# Altium schematic sheet Processor.SchDoc
size A
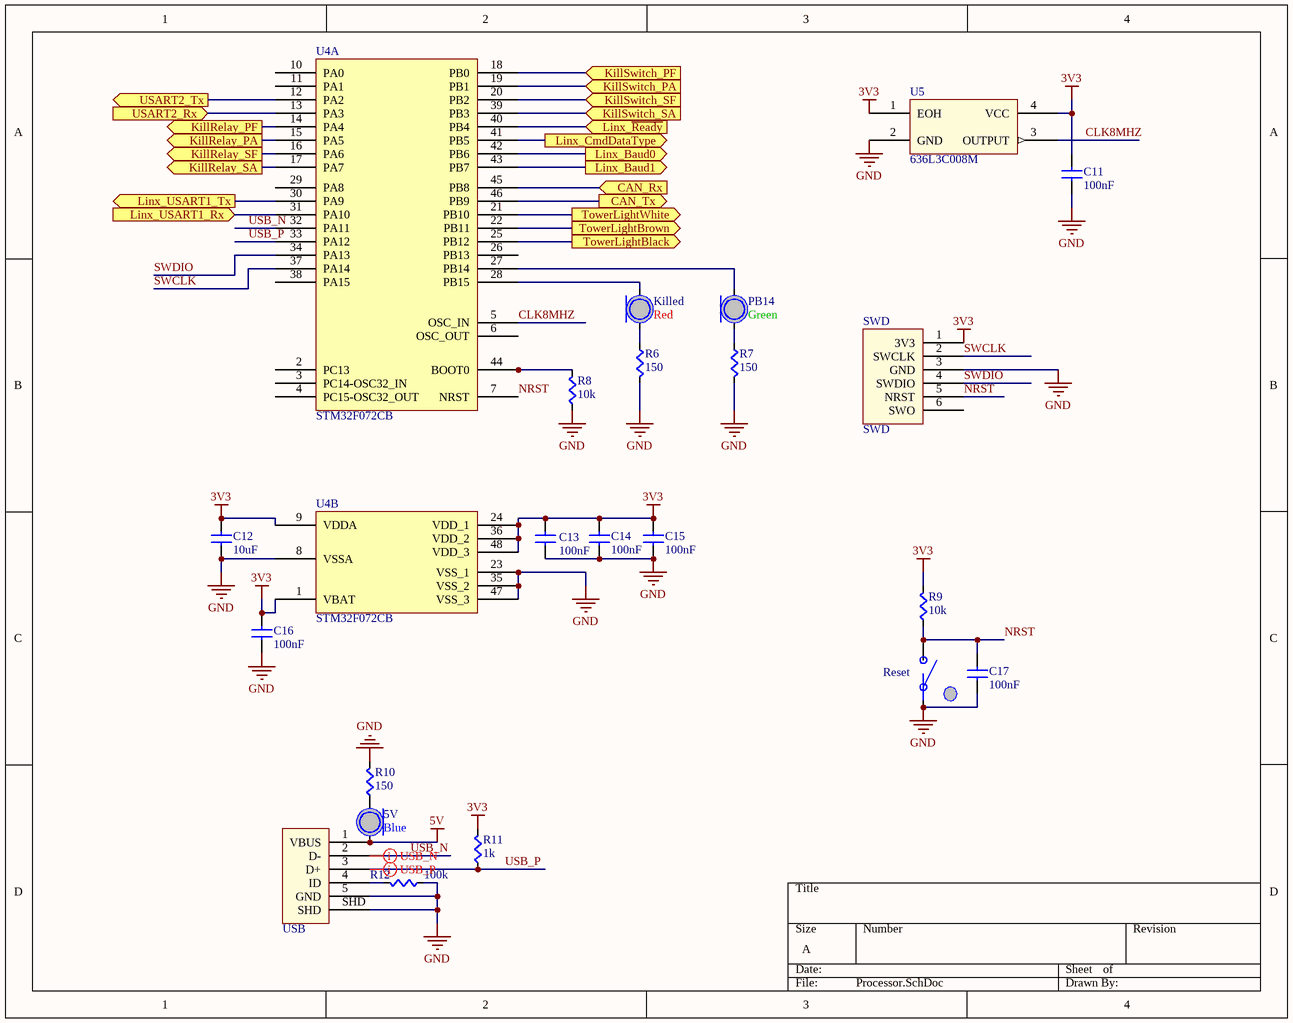
[diagram p0: Processor.SchDoc]

## Parts
5V  Color: Blue  [LED0603]  (hidden comment: LED)
C11  value 100nF  [CAPC0603]  (hidden comment: Cap)
C12  value 10uF  [CAPC0603]  (hidden comment: Cap)
C13  value 100nF  [CAPC0603]  (hidden comment: Cap)
C14  value 100nF  [CAPC0603]  (hidden comment: Cap)
C15  value 100nF  [CAPC0603]  (hidden comment: Cap)
C16  value 100nF  [CAPC0603]  (hidden comment: Cap)
C17  value 100nF  [CAPC0603]  (hidden comment: Cap)
Killed  Color: Red  [LED0603]  (hidden comment: LED)
PB14  Color: Green  [LED0603]  (hidden comment: LED)
R6  value 150  [RES0603]  (hidden comment: Res)
R7  value 150  [RES0603]  (hidden comment: Res)
R8  value 10k  [RES0603]  (hidden comment: Res)
R9  value 10k  [RES0603]  (hidden comment: Res)
R10  value 150  [RES0603]  (hidden comment: Res)
R11  value 1k  [RES0603]  (hidden comment: Res)
R12  value 100k  [RES0603]  (hidden comment: Res)
Reset  Button  [PTS645xxxxSMTR92]  (value not drawn)
SWD  SWD  [SWD_STM32]
U4  STM32F072CB  [STM32F072CB]  (parts A,B of 2)
U5  636L3C008M  [636L3C]
USB  USB Micro  [10118192-0001LF]  (value not drawn)

## Ports
CAN_Rx (in), CAN_Tx (out), KillRelay_PA (out), KillRelay_PF (out), KillRelay_SA (out), KillRelay_SF (out), KillSwitch_PA (in), KillSwitch_PF (in), KillSwitch_SA (in), KillSwitch_SF (in), Linx_Baud0 (out), Linx_Baud1 (out), Linx_CmdDataType (out), Linx_USART1_Rx (in), Linx_USART1_Tx (out), Linx_~{Ready} (in), TowerLightBlack (out), TowerLightBrown (out), TowerLightWhite (out), USART2_Rx (in), USART2_Tx (out)

## Nets
3V3: C11.1(A) C12.2(B) C13.1(A) C14.1(A) C15.1(A) C16.1(A) R9.1(A) R11.1(A) SWD.1(3V3) U4.1(VBAT) U4.9(VDDA) U4.24(VDD_1) U4.36(VDD_2) U4.48(VDD_3) U5.1(EOH) U5.4(VCC)
5V: 5V.A USB.1(VBUS)
GND: C11.2(B) C12.1(A) C13.2(B) C14.2(B) C15.2(B) C16.2(B) C17.2(B) R6.1(A) R7.1(A) R8.2(B) R10.1(A) R12.2(B) Reset.A SWD.3(GND) U4.8(VSSA) U4.23(VSS_1) U4.35(VSS_2) U4.47(VSS_3) U5.2(GND) USB.5(GND) USB.SHD
CAN_Rx: U4.45(PB8) ; port CAN_Rx
CAN_Tx: U4.46(PB9) ; port CAN_Tx
CLK8MHZ: U4.5(OSC_IN) U5.3(OUTPUT)
KillRelay_PA: U4.15(PA5) ; port KillRelay_PA
KillRelay_PF: U4.14(PA4) ; port KillRelay_PF
KillRelay_SA: U4.17(PA7) ; port KillRelay_SA
KillRelay_SF: U4.16(PA6) ; port KillRelay_SF
KillSwitch_PA: U4.19(PB1) ; port KillSwitch_PA
KillSwitch_PF: U4.18(PB0) ; port KillSwitch_PF
KillSwitch_SA: U4.39(PB3) ; port KillSwitch_SA
KillSwitch_SF: U4.20(PB2) ; port KillSwitch_SF
Linx_Baud0: U4.42(PB6) ; port Linx_Baud0
Linx_Baud1: U4.43(PB7) ; port Linx_Baud1
Linx_CmdDataType: U4.41(PB5) ; port Linx_CmdDataType
Linx_~{Ready}: U4.40(PB4) ; port Linx_~{Ready}
Linx_USART1_Rx: U4.31(PA10) ; port Linx_USART1_Rx
Linx_USART1_Tx: U4.30(PA9) ; port Linx_USART1_Tx
NRST: C17.1(A) R9.2(B) Reset.B SWD.5(NRST) U4.7(NRST)
SWCLK: SWD.2(SWCLK) U4.37(PA14)
SWDIO: SWD.4(SWDIO) U4.34(PA13)
TowerLightBlack: U4.25(PB12) ; port TowerLightBlack
TowerLightBrown: U4.22(PB11) ; port TowerLightBrown
TowerLightWhite: U4.21(PB10) ; port TowerLightWhite
USART2_Rx: U4.13(PA3) ; port USART2_Rx
USART2_Tx: U4.12(PA2) ; port USART2_Tx
USB_N: U4.32(PA11) USB.2(D-)
USB_P: R11.2(B) U4.33(PA12) USB.3(D+)
Net5V_C: 5V.C R10.2(B)
NetKilled_A: Killed.A U4.28(PB15)
NetKilled_C: Killed.C R6.2(B)
NetPB14_A: PB14.A U4.27(PB14)
NetPB14_C: PB14.C R7.2(B)
NetR8_1: R8.1(A) U4.44(BOOT0)
NetR12_1: R12.1(A) USB.4(ID)

Not connected (* = marked no-connect by the designer): SWD 6(SWO); U4 2(PC13) 3(PC14-OSC32_IN) 4(PC15-OSC32_OUT) 6(OSC_OUT) 10(PA0) 11(PA1) 26(PB13) 29(PA8) 38(PA15)

## Layout directives
differential pair: USB_N, USB_P

## Library data of the parts
Reset = Button: SPST Button; Supplier 1: Digi-Key; Supplier Part Number 1: CKN9087CT-ND
SWD = SWD_STM32: SWD connector matching the pinout on STM Discovery Boards
U4 = STM32F072CB: MCU 32BIT 128KB FLASH 48LQFP; Supplier 1: Digi-Key; Supplier Part Number 1: 497-14645-ND
U5 = 636L3C: HCMOS/TTL Clock Oscillator; Supplier 1: Digi-Key; Supplier Part Number 1: CTX1005CT-ND
USB = USB Micro: USB Mini B Metal Shield SMT; Supplier 1: Digi-Key; Supplier Part Number 1: 609-4613-1-ND
5V Killed PB14 = LED: Supplier 1: Digi-Key
  5V: Supplier Part Number 1: 754-1434-1-ND
  Killed: Supplier Part Number 1: 754-1122-1-ND
  PB14: Supplier Part Number 1: 754-1116-1-ND
C11-C17 = Cap: Supplier 1: Digi-Key; Supplier Part Number 1: 1276-1000-1-ND
R6-R12 = Res: Supplier 1: Digi-Key
  R6-R10: Supplier Part Number 1: RMCF0603JT10K0CT-ND
  R11: Supplier Part Number 1: RMCF0603JT1K00CT-ND
  R12: Supplier Part Number 1: RMCF0603JT100KCT-ND